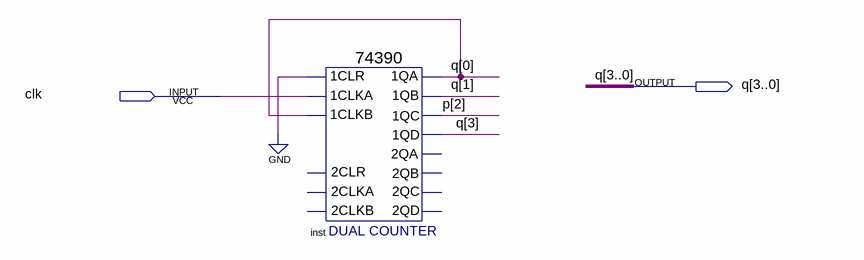
[diagram p0: schematic sheet]
// Quartus schematic cnt10.bdf as structural Verilog: 1 symbols, 2 pins
module cnt10 (
  input  clk,
  output [3:0] q
);

  wire [2:2] p;

  \74390  inst (
    .\1CLR (1'b0), .\1CLKA (clk), .\1CLKB (q[0]), .\1QA (q[0]), .\1QB (q[1]), .\1QC (p[2]), .\1QD (q[3]));  // open: 2CLKA, 2CLR, 2CLKB, 2QA, 2QB, 2QC, 2QD
endmodule
